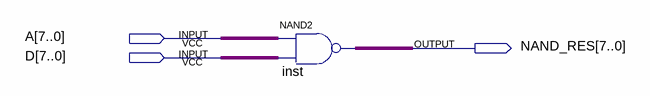
[diagram p0: schematic sheet]
// Quartus schematic NAND.bdf as structural Verilog: 1 symbols, 3 pins
module NAND (
  input  [7:0] A,
  input  [7:0] D,
  output [7:0] NAND_RES
);

  assign NAND_RES = ~(A & D);  // NAND2 inst, 8 bits wide
endmodule
